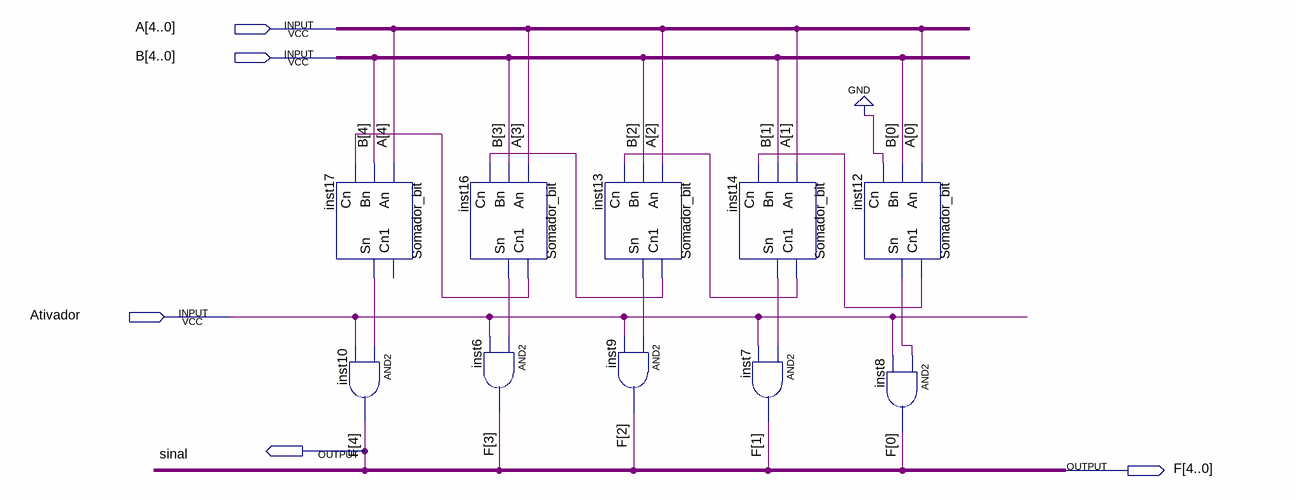
[diagram p0: schematic sheet]
// Quartus schematic soma_palavra_5_5.bdf as structural Verilog: 10 symbols, 5 pins
module soma_palavra_5_5 (
  input  [4:0] A,
  input  [4:0] B,
  input  Ativador,
  output sinal,
  output [4:0] F
);

  wire inst12_cn1, inst12_sn, inst13_cn1, inst13_sn, inst14_cn1, inst14_sn, inst16_cn1, inst16_sn, inst17_sn;

  Somador_bit inst17 (.An(A[4]), .Bn(B[4]), .Cn(inst16_cn1), .Sn(inst17_sn));  // open: Cn1
  and inst10 (F[4], inst17_sn, Ativador);
  Somador_bit inst16 (.An(A[3]), .Bn(B[3]), .Cn(inst13_cn1), .Cn1(inst16_cn1), .Sn(inst16_sn));
  and inst6 (F[3], inst16_sn, Ativador);
  Somador_bit inst13 (.An(A[2]), .Bn(B[2]), .Cn(inst14_cn1), .Cn1(inst13_cn1), .Sn(inst13_sn));
  and inst9 (F[2], inst13_sn, Ativador);
  Somador_bit inst14 (.An(A[1]), .Bn(B[1]), .Cn(inst12_cn1), .Cn1(inst14_cn1), .Sn(inst14_sn));
  and inst7 (F[1], inst14_sn, Ativador);
  Somador_bit inst12 (.An(A[0]), .Bn(B[0]), .Cn(1'b0), .Cn1(inst12_cn1), .Sn(inst12_sn));
  and inst8 (F[0], inst12_sn, Ativador);

  assign sinal = F[4];
endmodule
